# EasyEDA schematic Schema.json
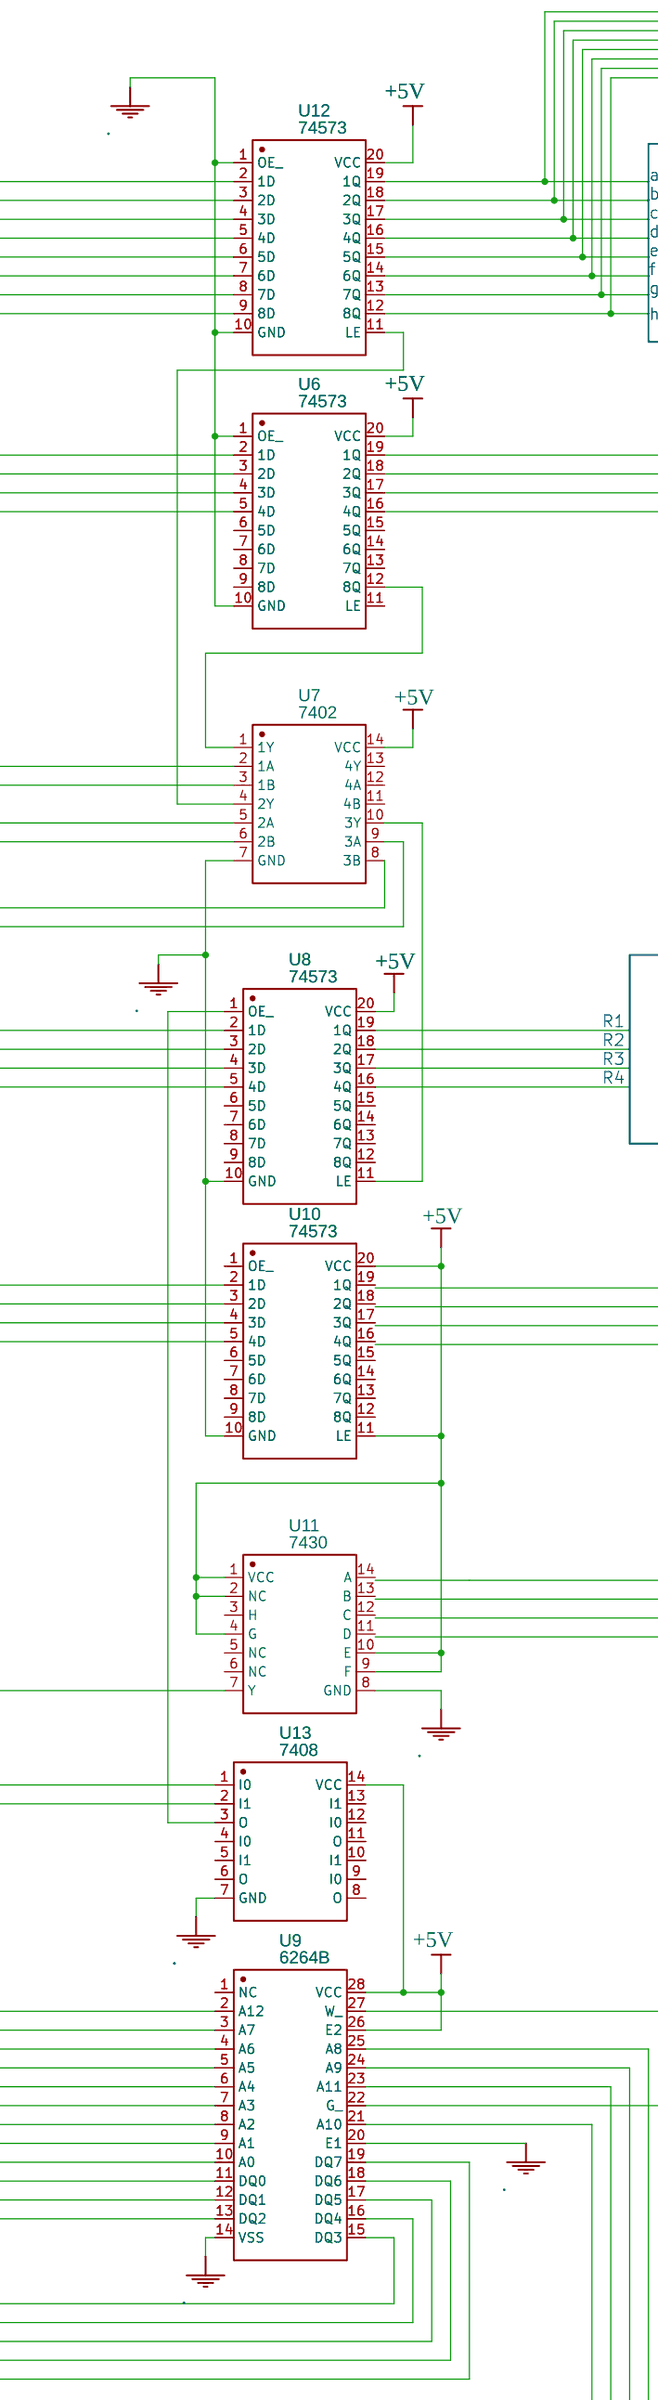
[diagram p0: schematic sheet]

## Parts
U6  74573  [DIP20]
U7  7402  [DIP14]
U8  74573  [DIP20]
U9  6264B  [DIP28-600]
U10  74573  [DIP20]
U11  7430  [SOIC-14_150MIL]
U12  74573  [DIP20]
U13  7408  [DIP14]

## Library data of the parts
U6-U10 U12 U13 = -: Manufacturer Part: ?
U11 = -: Supplier: LCSC; Manufacturer: Nexperia; Manufacturer Part: 74HCT164D,652; image: //image.lceda.cn/szlcsc/C5971.jpg; Supplier Part: C5971; Contributor: hotdog6394

## Nets
+5V: U6.20(VCC) U7.14(VCC) U8.20(VCC) U9.26(E2) U9.28(VCC) U10.11(LE) U10.20(VCC) U11.1(VCC) U11.2(NC) U11.4(G) U11.9(F) U11.10(E) U12.20(VCC) U13.14(VCC)
.: U6.1(OE_) U6.10(GND) U7.7(GND) U8.10(GND) U9.14(VSS) U9.20(E1) U10.10(GND) U11.8(GND) U12.1(OE_) U12.10(GND) U13.7(GND)
Net-(U6-2): U6.2(1D) U6.3(2D) U6.4(3D) U6.5(4D) U8.2(1D) U8.3(2D) U8.4(3D) U8.5(4D) U9.11(DQ0) U9.12(DQ1) U9.13(DQ2) U9.15(DQ3) U9.16(DQ4) U9.17(DQ5) U9.18(DQ6) U9.19(DQ7) U10.2(1D) U10.3(2D) U10.4(3D) U10.5(4D) U12.2(1D) U12.3(2D) U12.4(3D) U12.5(4D) U12.6(5D) U12.7(6D) U12.8(7D) U12.9(8D)
Net-(U6-12): U6.12(8Q) U7.1(1Y)
Net-(U7-2): U7.2(1A) U7.5(2A) U7.9(3A) U9.2(A12) U9.3(A7) U9.4(A6) U9.5(A5) U9.6(A4) U9.7(A3) U9.8(A2) U9.9(A1) U9.10(A0) U9.21(A10) U9.23(A11) U9.24(A9) U9.25(A8)
Net-(U7-3): U7.3(1B) U7.6(2B) U7.8(3B)
Net-(U7-4): U7.4(2Y) U12.11(LE)
Net-(U7-10): U7.10(3Y) U8.11(LE)
Net-(U8-1): U8.1(OE_) U13.3(O)

Not connected (* = marked no-connect by the designer): U6 6(5D) 7(6D) 8(7D) 9(8D) 11(LE) 13(7Q) 14(6Q) 15(5Q) 16(4Q) 17(3Q) 18(2Q) 19(1Q); U7 11(4B) 12(4A) 13(4Y); U8 6(5D) 7(6D) 8(7D) 9(8D) 12(8Q) 13(7Q) 14(6Q) 15(5Q) 16(4Q) 17(3Q) 18(2Q) 19(1Q); U9 1(NC) 22(G_) 27(W_); U10 1(OE_) 6(5D) 7(6D) 8(7D) 9(8D) 12(8Q) 13(7Q) 14(6Q) 15(5Q) 16(4Q) 17(3Q) 18(2Q) 19(1Q); U11 3(H) 5(NC) 6(NC) 7(Y) 11(D) 12(C) 13(B) 14(A); U12 12(8Q) 13(7Q) 14(6Q) 15(5Q) 16(4Q) 17(3Q) 18(2Q) 19(1Q); U13 1(I0) 2(I1) 4(I0) 5(I1) 6(O) 8(O) 9(I0) 10(I1) 11(O) 12(I0) 13(I1)

## Notes on the sheet
- D
- AB
- IW
- MR
- MW
- IR
- IA
- IT
- a
- a
- a
- a
- DB(0)
- a
- a
- a
- a
- DB(1)
- DB(2)
- b
- c
- f
- b
- b
- c
- f
- b
- b
- f
- b
- b
- c
- f
- b
- DB(3)
- d
- d
- c
- d
- d
- DB(4)
- e
- g
- e
- g
- e
- g
- e
- g
- DB(5)
- f
- e
- c
- f
- e
- c
- f
- e
- c
- f
- e
- c
- DB(6)
- g
- g
- g
- g
- DB(7)
- h
- d
- h
- h
- d
- h
- h
- d
- h
- h
- d
- h
- A1
- A2
- A3
- A4
- DB(0)
- DB(1)
- DB(2)
- DB(3)
- AB(0)
- AB(1)
- AB(2)
- DB(0)
- R1
- DB(1)
- R2
- R3
- DB(2)
- DB(3)
- R4
- C1
- C2
- C3
- C4
- DB(0)
- DB(1)
- DB(2)
- DB(3)
- AB(12)
- AB(6)
- AB(7)
- AB(5)
- AB(4)
- AB(3)
- AB(2)
- AB(0)
- AB(1)
- DB(0)
- DB(1)
- DB(2)
- DB(3)
- DB(4)
- DB(5)
- DB(6)
- DB(7)
- AB(10)
- AB(11)
- AB(9)
- AB(8)
- MR
- MW
